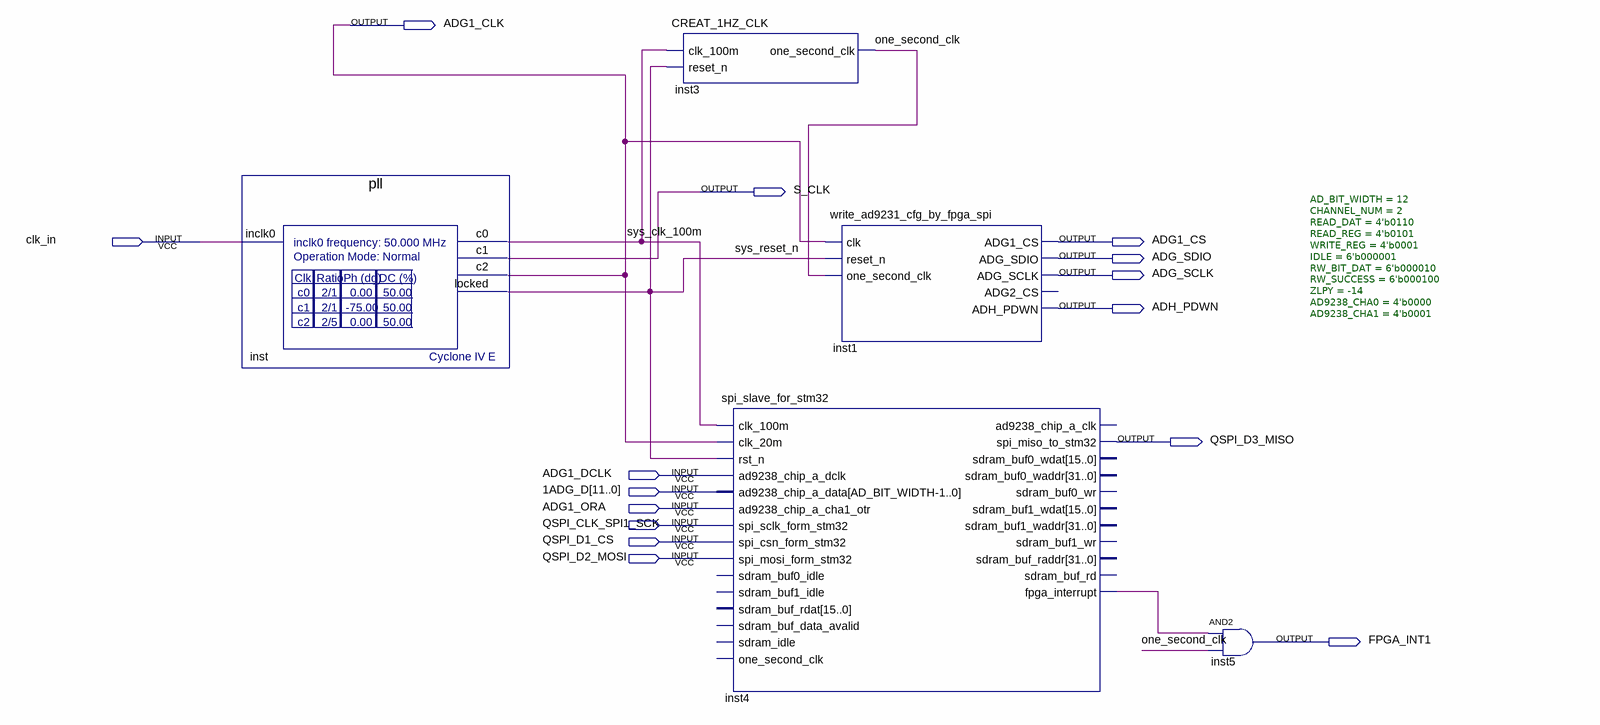
[diagram p0: schematic sheet]
// Quartus schematic 123456789.bdf as structural Verilog: 5 symbols, 15 pins
module \123456789  (
  input  clk_in,
  input  ADG1_DCLK,
  input  [11:0] \1ADG_D ,
  input  ADG1_ORA,
  input  QSPI_CLK_SPI1_SCK,
  input  QSPI_D1_CS,
  input  QSPI_D2_MOSI,
  output ADG1_CLK,
  output S_CLK,
  output ADG1_CS,
  output ADG_SDIO,
  output ADG_SCLK,
  output ADH_PDWN,
  output QSPI_D3_MISO,
  output FPGA_INT1
);

  wire inst4_fpga_interrupt, one_second_clk, sys_clk_100m, sys_reset_n;

  pll inst (.inclk0(clk_in), .c0(sys_clk_100m), .c1(S_CLK), .c2(ADG1_CLK), .locked(sys_reset_n));
  CREAT_1HZ_CLK inst3 (.clk_100m(sys_clk_100m), .reset_n(sys_reset_n), .one_second_clk(one_second_clk));
  spi_slave_for_stm32 #(.AD_BIT_WIDTH(12), .CHANNEL_NUM(2), .READ_DAT(4'b0110), .READ_REG(4'b0101), .WRITE_REG(4'b0001), .IDLE(6'b000001), .RW_BIT_DAT(6'b000010), .RW_SUCCESS(6'b000100), .ZLPY(-14), .AD9238_CHA0(4'b0000), .AD9238_CHA1(4'b0001)) inst4 (
    .clk_100m(sys_clk_100m), .clk_20m(ADG1_CLK), .rst_n(sys_reset_n), .ad9238_chip_a_dclk(ADG1_DCLK),
    .ad9238_chip_a_data(\1ADG_D ), .ad9238_chip_a_cha1_otr(ADG1_ORA),
    .spi_sclk_form_stm32(QSPI_CLK_SPI1_SCK), .spi_csn_form_stm32(QSPI_D1_CS),
    .spi_mosi_form_stm32(QSPI_D2_MOSI), .spi_miso_to_stm32(QSPI_D3_MISO),
    .fpga_interrupt(inst4_fpga_interrupt));  // open: sdram_buf0_idle, sdram_buf1_idle, sdram_buf_rdat, sdram_buf_data_avalid, sdram_idle, one_second_clk, ad9238_chip_a_clk, sdram_buf0_wdat, sdram_buf0_waddr, sdram_buf0_wr, sdram_buf1_wdat, sdram_buf1_waddr, sdram_buf1_wr, sdram_buf_raddr, sdram_buf_rd
  write_ad9231_cfg_by_fpga_spi inst1 (
    .clk(ADG1_CLK), .reset_n(sys_reset_n), .one_second_clk(one_second_clk), .ADG1_CS(ADG1_CS),
    .ADG_SCLK(ADG_SCLK), .ADH_PDWN(ADH_PDWN), .ADG_SDIO(ADG_SDIO));  // open: ADG2_CS
  and inst5 (FPGA_INT1, inst4_fpga_interrupt, one_second_clk);
endmodule
